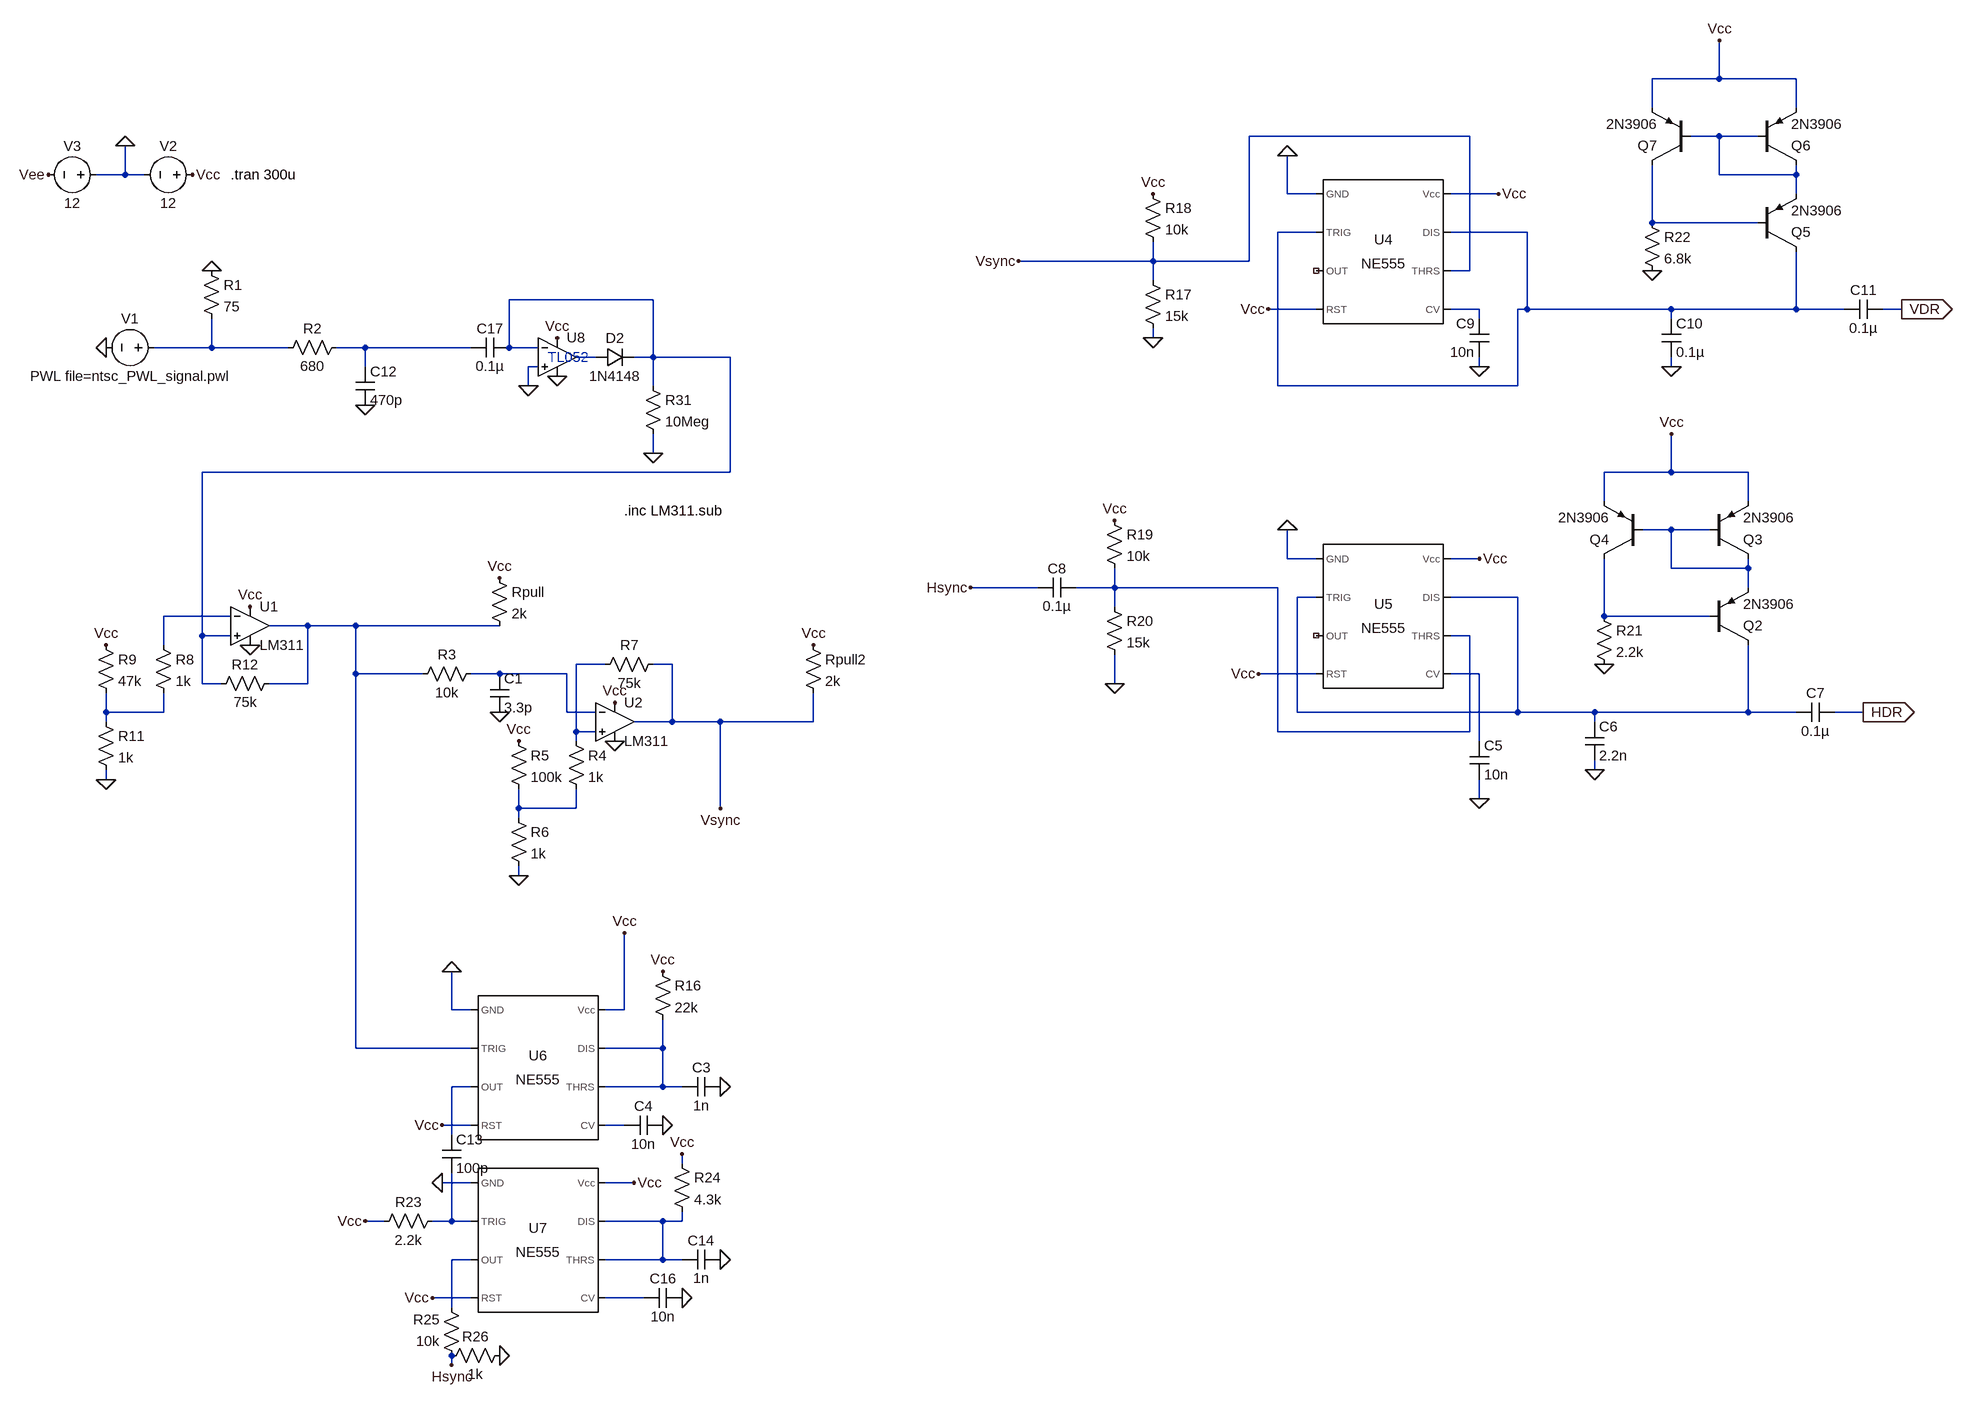
[diagram p0: schematic thirdIteration.asc]
thirdIteration.asc, the LTspice schematic file:
Version 4
SHEET 1 3116 2052
WIRE 2704 -640 2704 -704
WIRE 2704 -640 2592 -640
WIRE 2832 -640 2704 -640
WIRE 2592 -592 2592 -640
WIRE 2832 -592 2832 -640
WIRE 2288 -544 1920 -544
WIRE 2704 -544 2656 -544
WIRE 2768 -544 2704 -544
WIRE -848 -480 -848 -528
WIRE -848 -480 -896 -480
WIRE -816 -480 -848 -480
WIRE 2704 -480 2704 -544
WIRE 2832 -480 2832 -496
WIRE 2832 -480 2704 -480
WIRE 1984 -448 1984 -512
WIRE 2032 -448 1984 -448
WIRE 2336 -448 2256 -448
WIRE 2832 -448 2832 -480
WIRE 2592 -400 2592 -496
WIRE 2768 -400 2592 -400
WIRE 2032 -384 1968 -384
WIRE 2384 -384 2256 -384
WIRE 1760 -336 1760 -368
WIRE 1760 -336 1536 -336
WIRE 1920 -336 1920 -544
WIRE 1920 -336 1760 -336
WIRE 2288 -320 2288 -544
WIRE 2288 -320 2256 -320
WIRE 1760 -304 1760 -336
WIRE 32 -272 -208 -272
WIRE 2032 -256 1952 -256
WIRE 2304 -256 2256 -256
WIRE 2384 -256 2384 -384
WIRE 2384 -256 2368 -256
WIRE 2624 -256 2384 -256
WIRE 2832 -256 2832 -352
WIRE 2832 -256 2624 -256
WIRE 2912 -256 2832 -256
WIRE 3008 -256 2976 -256
WIRE 2304 -240 2304 -256
WIRE 2624 -240 2624 -256
WIRE 1760 -208 1760 -224
WIRE -704 -192 -704 -240
WIRE -704 -192 -800 -192
WIRE -576 -192 -704 -192
WIRE -448 -192 -496 -192
WIRE -272 -192 -448 -192
WIRE -208 -192 -208 -272
WIRE -160 -192 -208 -192
WIRE -64 -176 -96 -176
WIRE 32 -176 32 -272
WIRE 32 -176 0 -176
WIRE 160 -176 32 -176
WIRE -448 -160 -448 -192
WIRE -160 -160 -176 -160
WIRE 2304 -160 2304 -176
WIRE 2624 -160 2624 -176
WIRE -176 -128 -176 -160
WIRE 32 -128 32 -176
WIRE 1968 -128 1968 -384
WIRE 2368 -128 2368 -256
WIRE 2368 -128 1968 -128
WIRE 32 -16 32 -48
WIRE 160 16 160 -176
WIRE 160 16 -720 16
WIRE 2624 16 2624 -48
WIRE 2624 16 2512 16
WIRE 2752 16 2624 16
WIRE 2512 64 2512 16
WIRE 2752 64 2752 16
WIRE 2624 112 2576 112
WIRE 2688 112 2624 112
WIRE 1984 160 1984 112
WIRE 2032 160 1984 160
WIRE 2304 160 2256 160
WIRE 2624 176 2624 112
WIRE 2752 176 2752 160
WIRE 2752 176 2624 176
WIRE 1568 208 1456 208
WIRE 1696 208 1696 176
WIRE 1696 208 1632 208
WIRE 1968 208 1696 208
WIRE 2752 208 2752 176
WIRE 2032 224 2000 224
WIRE 2368 224 2256 224
WIRE 1696 240 1696 208
WIRE -672 256 -784 256
WIRE 2512 256 2512 160
WIRE 2688 256 2512 256
WIRE -544 272 -608 272
WIRE -464 272 -544 272
WIRE -224 272 -464 272
WIRE -720 288 -720 16
WIRE -672 288 -720 288
WIRE 2288 288 2256 288
WIRE -784 304 -784 256
WIRE -48 336 -96 336
WIRE 64 336 32 336
WIRE -464 352 -464 272
WIRE -352 352 -464 352
WIRE -224 352 -272 352
WIRE -112 352 -224 352
WIRE 2032 352 1936 352
WIRE 2304 352 2256 352
WIRE -720 368 -720 288
WIRE -688 368 -720 368
WIRE -544 368 -544 272
WIRE -544 368 -608 368
WIRE 1696 368 1696 320
WIRE -880 416 -880 384
WIRE -784 416 -784 384
WIRE -784 416 -880 416
WIRE -112 416 -112 352
WIRE -64 416 -112 416
WIRE 2000 416 2000 224
WIRE 2368 416 2368 224
WIRE 2368 416 2000 416
WIRE 2496 416 2368 416
WIRE 2752 416 2752 304
WIRE 2752 416 2496 416
WIRE 2832 416 2752 416
WIRE 2944 416 2896 416
WIRE -880 432 -880 416
WIRE 64 432 64 336
WIRE 64 432 0 432
WIRE 144 432 64 432
WIRE 384 432 384 384
WIRE 384 432 144 432
WIRE 2496 432 2496 416
WIRE -96 448 -96 336
WIRE -64 448 -96 448
WIRE 1968 448 1968 208
WIRE 2288 448 2288 288
WIRE 2288 448 1968 448
WIRE -96 464 -96 448
WIRE 2304 464 2304 352
WIRE 2496 512 2496 496
WIRE -880 528 -880 512
WIRE 2304 560 2304 528
WIRE -192 576 -192 544
WIRE -96 576 -96 544
WIRE -96 576 -192 576
WIRE 144 576 144 432
WIRE -192 592 -192 576
WIRE -192 688 -192 672
WIRE -304 912 -304 848
WIRE -272 912 -304 912
WIRE -16 912 -16 784
WIRE -16 912 -48 912
WIRE -464 976 -464 352
WIRE -272 976 -464 976
WIRE 48 976 48 928
WIRE 48 976 -48 976
WIRE -272 1040 -304 1040
WIRE 48 1040 48 976
WIRE 48 1040 -48 1040
WIRE 80 1040 48 1040
WIRE -272 1104 -320 1104
WIRE -16 1104 -48 1104
WIRE -304 1120 -304 1040
WIRE 80 1168 80 1152
WIRE -272 1200 -320 1200
WIRE 0 1200 -48 1200
WIRE -416 1264 -448 1264
WIRE -304 1264 -304 1184
WIRE -304 1264 -336 1264
WIRE -272 1264 -304 1264
WIRE 48 1264 -48 1264
WIRE 80 1264 80 1248
WIRE 80 1264 48 1264
WIRE -272 1328 -304 1328
WIRE 48 1328 48 1264
WIRE 48 1328 -48 1328
WIRE 80 1328 48 1328
WIRE -272 1392 -336 1392
WIRE 16 1392 -48 1392
WIRE -304 1408 -304 1328
WIRE -304 1504 -304 1488
FLAG -880 -192 0
FLAG -704 -320 0
FLAG 1760 -208 0
FLAG 1760 -448 Vcc
FLAG 1696 96 Vcc
FLAG 1696 368 0
FLAG 1984 112 0
FLAG 2304 560 0
FLAG 2496 512 0
FLAG 2512 336 0
FLAG 2944 416 HDR
IOPIN 2944 416 Out
FLAG 2336 -448 Vcc
FLAG 1984 -512 0
FLAG 2304 -160 0
FLAG 1952 -256 Vcc
FLAG 2592 -320 0
FLAG 2704 -704 Vcc
FLAG 2624 -160 0
FLAG 3008 -256 VDR
IOPIN 3008 -256 Out
FLAG 1536 -336 Vsync
FLAG 1456 208 Hsync
FLAG -448 -96 0
FLAG -880 528 0
FLAG -640 240 Vcc
FLAG -736 -480 Vcc
FLAG -976 -480 Vee
FLAG -848 -528 0
FLAG 2304 160 Vcc
FLAG 2624 -48 Vcc
FLAG 1936 352 Vcc
FLAG -224 192 Vcc
FLAG -880 304 Vcc
FLAG -640 304 0
FLAG -16 784 Vcc
FLAG -304 848 0
FLAG 144 1040 0
FLAG 48 848 Vcc
FLAG 48 1104 0
FLAG -320 1104 Vcc
FLAG -320 1200 0
FLAG 80 1152 Vcc
FLAG -448 1264 Vcc
FLAG -336 1392 Vcc
FLAG 144 1328 0
FLAG 80 1392 0
FLAG -304 1504 Hsync
FLAG -224 1488 0
FLAG 0 1200 Vcc
FLAG 32 -16 0
FLAG -128 -208 Vcc
FLAG -176 -128 0
FLAG -128 -144 0
FLAG -224 416 0
FLAG -192 688 0
FLAG -32 400 Vcc
FLAG -192 464 Vcc
FLAG -32 464 0
FLAG 144 576 Vsync
FLAG 384 304 Vcc
DATAFLAG -880 416 ""
DATAFLAG -192 576 ""
SYMBOL voltage -784 -192 R90
WINDOW 0 -32 56 VBottom 2
WINDOW 3 32 56 VTop 2
WINDOW 123 0 0 Left 0
WINDOW 39 0 0 Left 0
SYMATTR InstName V1
SYMATTR Value PWL file=ntsc_PWL_signal.pwl
SYMBOL res -720 -336 R0
SYMATTR InstName R1
SYMATTR Value 75
SYMBOL res 1744 -320 R0
SYMATTR InstName R17
SYMATTR Value 15k
SYMBOL res 1744 -464 R0
SYMATTR InstName R18
SYMATTR Value 10k
SYMBOL Misc\\NE555 2144 -352 R0
SYMATTR InstName U4
SYMBOL Misc\\NE555 2144 256 R0
SYMATTR InstName U5
SYMBOL res 1680 80 R0
SYMATTR InstName R19
SYMATTR Value 10k
SYMBOL res 1680 224 R0
SYMATTR InstName R20
SYMATTR Value 15k
SYMBOL cap 2288 464 R0
SYMATTR InstName C5
SYMATTR Value 10n
SYMBOL cap 2480 432 R0
SYMATTR InstName C6
SYMATTR Value 2.2n
SYMBOL cap 2896 400 R90
WINDOW 0 0 32 VBottom 2
WINDOW 3 32 32 VTop 2
SYMATTR InstName C7
SYMATTR Value 0.1µ
SYMBOL pnp 2688 304 M180
SYMATTR InstName Q2
SYMATTR Value 2N3906
SYMBOL pnp 2688 160 M180
SYMATTR InstName Q3
SYMATTR Value 2N3906
SYMBOL pnp 2576 160 R180
SYMATTR InstName Q4
SYMATTR Value 2N3906
SYMBOL res 2496 240 R0
SYMATTR InstName R21
SYMATTR Value 2.2k
SYMBOL cap 1632 192 R90
WINDOW 0 0 32 VBottom 2
WINDOW 3 32 32 VTop 2
SYMATTR InstName C8
SYMATTR Value 0.1µ
SYMBOL cap 2320 -176 R180
WINDOW 0 24 56 Left 2
WINDOW 3 24 8 Left 2
SYMATTR InstName C9
SYMATTR Value 10n
SYMBOL pnp 2768 -352 M180
SYMATTR InstName Q5
SYMATTR Value 2N3906
SYMBOL pnp 2768 -496 M180
SYMATTR InstName Q6
SYMATTR Value 2N3906
SYMBOL pnp 2656 -496 R180
SYMATTR InstName Q7
SYMATTR Value 2N3906
SYMBOL res 2576 -416 R0
SYMATTR InstName R22
SYMATTR Value 6.8k
SYMBOL cap 2608 -240 R0
SYMATTR InstName C10
SYMATTR Value 0.1µ
SYMBOL cap 2976 -272 R90
WINDOW 0 0 32 VBottom 2
WINDOW 3 32 32 VTop 2
SYMATTR InstName C11
SYMATTR Value 0.1µ
SYMBOL res -480 -208 R90
WINDOW 0 0 56 VBottom 2
WINDOW 3 32 56 VTop 2
SYMATTR InstName R2
SYMATTR Value 680
SYMBOL cap -464 -160 R0
SYMATTR InstName C12
SYMATTR Value 470p
SYMBOL res -800 288 R0
SYMATTR InstName R8
SYMATTR Value 1k
SYMBOL res -896 288 R0
SYMATTR InstName R9
SYMATTR Value 47k
SYMBOL res -896 416 R0
SYMATTR InstName R11
SYMATTR Value 1k
SYMBOL res -592 352 R90
WINDOW 0 0 56 VBottom 2
WINDOW 3 32 56 VTop 2
SYMATTR InstName R12
SYMATTR Value 75k
SYMBOL res -240 176 R0
SYMATTR InstName Rpull
SYMATTR Value 2k
SYMBOL voltage -720 -480 R90
WINDOW 0 -32 56 VBottom 2
WINDOW 3 32 56 VTop 2
SYMATTR InstName V2
SYMATTR Value 12
SYMBOL voltage -880 -480 R90
WINDOW 0 -32 56 VBottom 2
WINDOW 3 32 56 VTop 2
SYMATTR InstName V3
SYMATTR Value 12
SYMBOL OpAmps\\opamp2 -640 208 R0
SYMATTR InstName U1
SYMATTR Value LM311
SYMBOL Misc\\NE555 -160 1008 R0
SYMATTR InstName U6
SYMBOL cap 144 1024 R90
WINDOW 0 0 32 VBottom 2
WINDOW 3 32 32 VTop 2
SYMATTR InstName C3
SYMATTR Value 1n
SYMBOL res 32 832 R0
SYMATTR InstName R16
SYMATTR Value 22k
SYMBOL cap 48 1088 R90
WINDOW 0 0 32 VBottom 2
WINDOW 3 32 32 VTop 2
SYMATTR InstName C4
SYMATTR Value 10n
SYMBOL Misc\\NE555 -160 1296 R0
SYMATTR InstName U7
SYMBOL cap -320 1120 R0
SYMATTR InstName C13
SYMATTR Value 100p
SYMBOL res -320 1248 R90
WINDOW 0 0 56 VBottom 2
WINDOW 3 32 56 VTop 2
SYMATTR InstName R23
SYMATTR Value 2.2k
SYMBOL res 64 1152 R0
SYMATTR InstName R24
SYMATTR Value 4.3k
SYMBOL cap 144 1312 R90
WINDOW 0 0 32 VBottom 2
WINDOW 3 32 32 VTop 2
SYMATTR InstName C14
SYMATTR Value 1n
SYMBOL cap 80 1376 R90
WINDOW 0 0 32 VBottom 2
WINDOW 3 32 32 VTop 2
SYMATTR InstName C16
SYMATTR Value 10n
SYMBOL res -288 1504 R180
WINDOW 0 36 76 Left 2
WINDOW 3 36 40 Left 2
SYMATTR InstName R25
SYMATTR Value 10k
SYMBOL res -320 1504 R270
WINDOW 0 32 56 VTop 2
WINDOW 3 0 56 VBottom 2
SYMATTR InstName R26
SYMATTR Value 1k
SYMBOL cap -208 -208 R90
WINDOW 0 0 32 VBottom 2
WINDOW 3 32 32 VTop 2
SYMATTR InstName C17
SYMATTR Value 0.1µ
SYMBOL OpAmps\\UniversalOpAmp2 -128 -176 R0
SYMATTR InstName U8
SYMBOL diode -64 -160 R270
WINDOW 0 32 32 VTop 2
WINDOW 3 0 32 VBottom 2
SYMATTR InstName D2
SYMATTR Value 1N4148
SYMBOL res 16 -144 R0
SYMATTR InstName R31
SYMATTR Value 10Meg
SYMBOL res -256 336 R90
WINDOW 0 0 56 VBottom 2
WINDOW 3 32 56 VTop 2
SYMATTR InstName R3
SYMATTR Value 10k
SYMBOL cap -240 352 R0
SYMATTR InstName C1
SYMATTR Value 3.3p
SYMBOL res -112 448 R0
SYMATTR InstName R4
SYMATTR Value 1k
SYMBOL res -208 448 R0
SYMATTR InstName R5
SYMATTR Value 100k
SYMBOL res -208 576 R0
SYMATTR InstName R6
SYMATTR Value 1k
SYMBOL res 48 320 R90
WINDOW 0 0 56 VBottom 2
WINDOW 3 32 56 VTop 2
SYMATTR InstName R7
SYMATTR Value 75k
SYMBOL res 368 288 R0
SYMATTR InstName Rpull2
SYMATTR Value 2k
SYMBOL OpAmps\\opamp2 -32 368 R0
SYMATTR InstName U2
SYMATTR Value LM311
TEXT -672 -480 Left 2 !.tran 300u
TEXT -16 80 Left 2 !.inc LM311.sub
TEXT -144 -176 Left 2 ;TL052

The netlist it stands for:
* thirdIteration.asc
V1 N006 0 PWL file=ntsc_PWL_signal.pwl
R1 0 N006 75
R17 Vsync 0 15k
R18 Vcc Vsync 10k
XU4 0 N003 NC_01 Vcc N005 Vsync N003 Vcc NE555  ; pins GND TRIG OUT RST CV THRS DIS Vcc
XU5 0 N011 NC_02 Vcc N017 N010 N011 Vcc NE555  ; pins GND TRIG OUT RST CV THRS DIS Vcc
R19 Vcc N010 10k
R20 N010 0 15k
C5 N017 0 10n
C6 N011 0 2.2n
C7 HDR N011 0.1µ
Q2 N011 N013 N009 0 2N3906
Q3 N009 N009 Vcc 0 2N3906
Q4 N013 N009 Vcc 0 2N3906
R21 N013 0 2.2k
C8 N010 Hsync 0.1µ
C9 0 N005 10n
Q5 N003 N002 N001 0 2N3906
Q6 N001 N001 Vcc 0 2N3906
Q7 N002 N001 Vcc 0 2N3906
R22 N002 0 6.8k
C10 N003 0 0.1µ
C11 VDR N003 0.1µ
R2 N007 N006 680
C12 N007 0 470p
R8 N012 N018 1k
R9 Vcc N018 47k
R11 N018 0 1k
R12 N014 N004 75k
Rpull Vcc N014 2k
V2 Vcc 0 12
V3 0 Vee 12
XU1 N004 N012 Vcc 0 N014 LM311  ; pins In+ In- V+ V- OUT
XU6 0 N014 N021 Vcc N022 N020 N020 Vcc NE555  ; pins GND TRIG OUT RST CV THRS DIS Vcc
C3 0 N020 1n
R16 Vcc N020 22k
C4 0 N022 10n
XU7 0 N023 N025 Vcc N026 N024 N024 Vcc NE555  ; pins GND TRIG OUT RST CV THRS DIS Vcc
C13 N021 N023 100p
R23 N023 Vcc 2.2k
R24 Vcc N024 4.3k
C14 0 N024 1n
C16 0 N026 10n
R25 Hsync N025 10k
R26 Hsync 0 1k
C17 N004 N007 0.1µ
XU8 0 N004 Vcc 0 N008 level2 Avol=1Meg GBW=10Meg Slew=10Meg Ilimit=25m Rail=0 Vos=0 En=0 Enk=0 In=0 Ink=0 Rin=500Meg  ; pins In+ In- V+ V- OUT
D2 N008 N004 1N4148
R31 N004 0 10Meg
R3 N016 N014 10k
C1 N016 0 3.3p
R4 N015 N019 1k
R5 Vcc N019 100k
R6 N019 0 1k
R7 Vsync N015 75k
Rpull2 Vcc Vsync 2k
XU2 N015 N016 Vcc 0 Vsync LM311  ; pins In+ In- V+ V- OUT
.model D D
.lib standard.dio
.model NPN NPN
.model PNP PNP
.lib standard.bjt
.tran 300u
.inc LM311.sub
* TL052
.lib NE555.sub
.lib UniversalOpAmp2.lib
.backanno
.end